# EAGLE schematic schematic hovedboks version 3 (EAGLE 9.6.2)
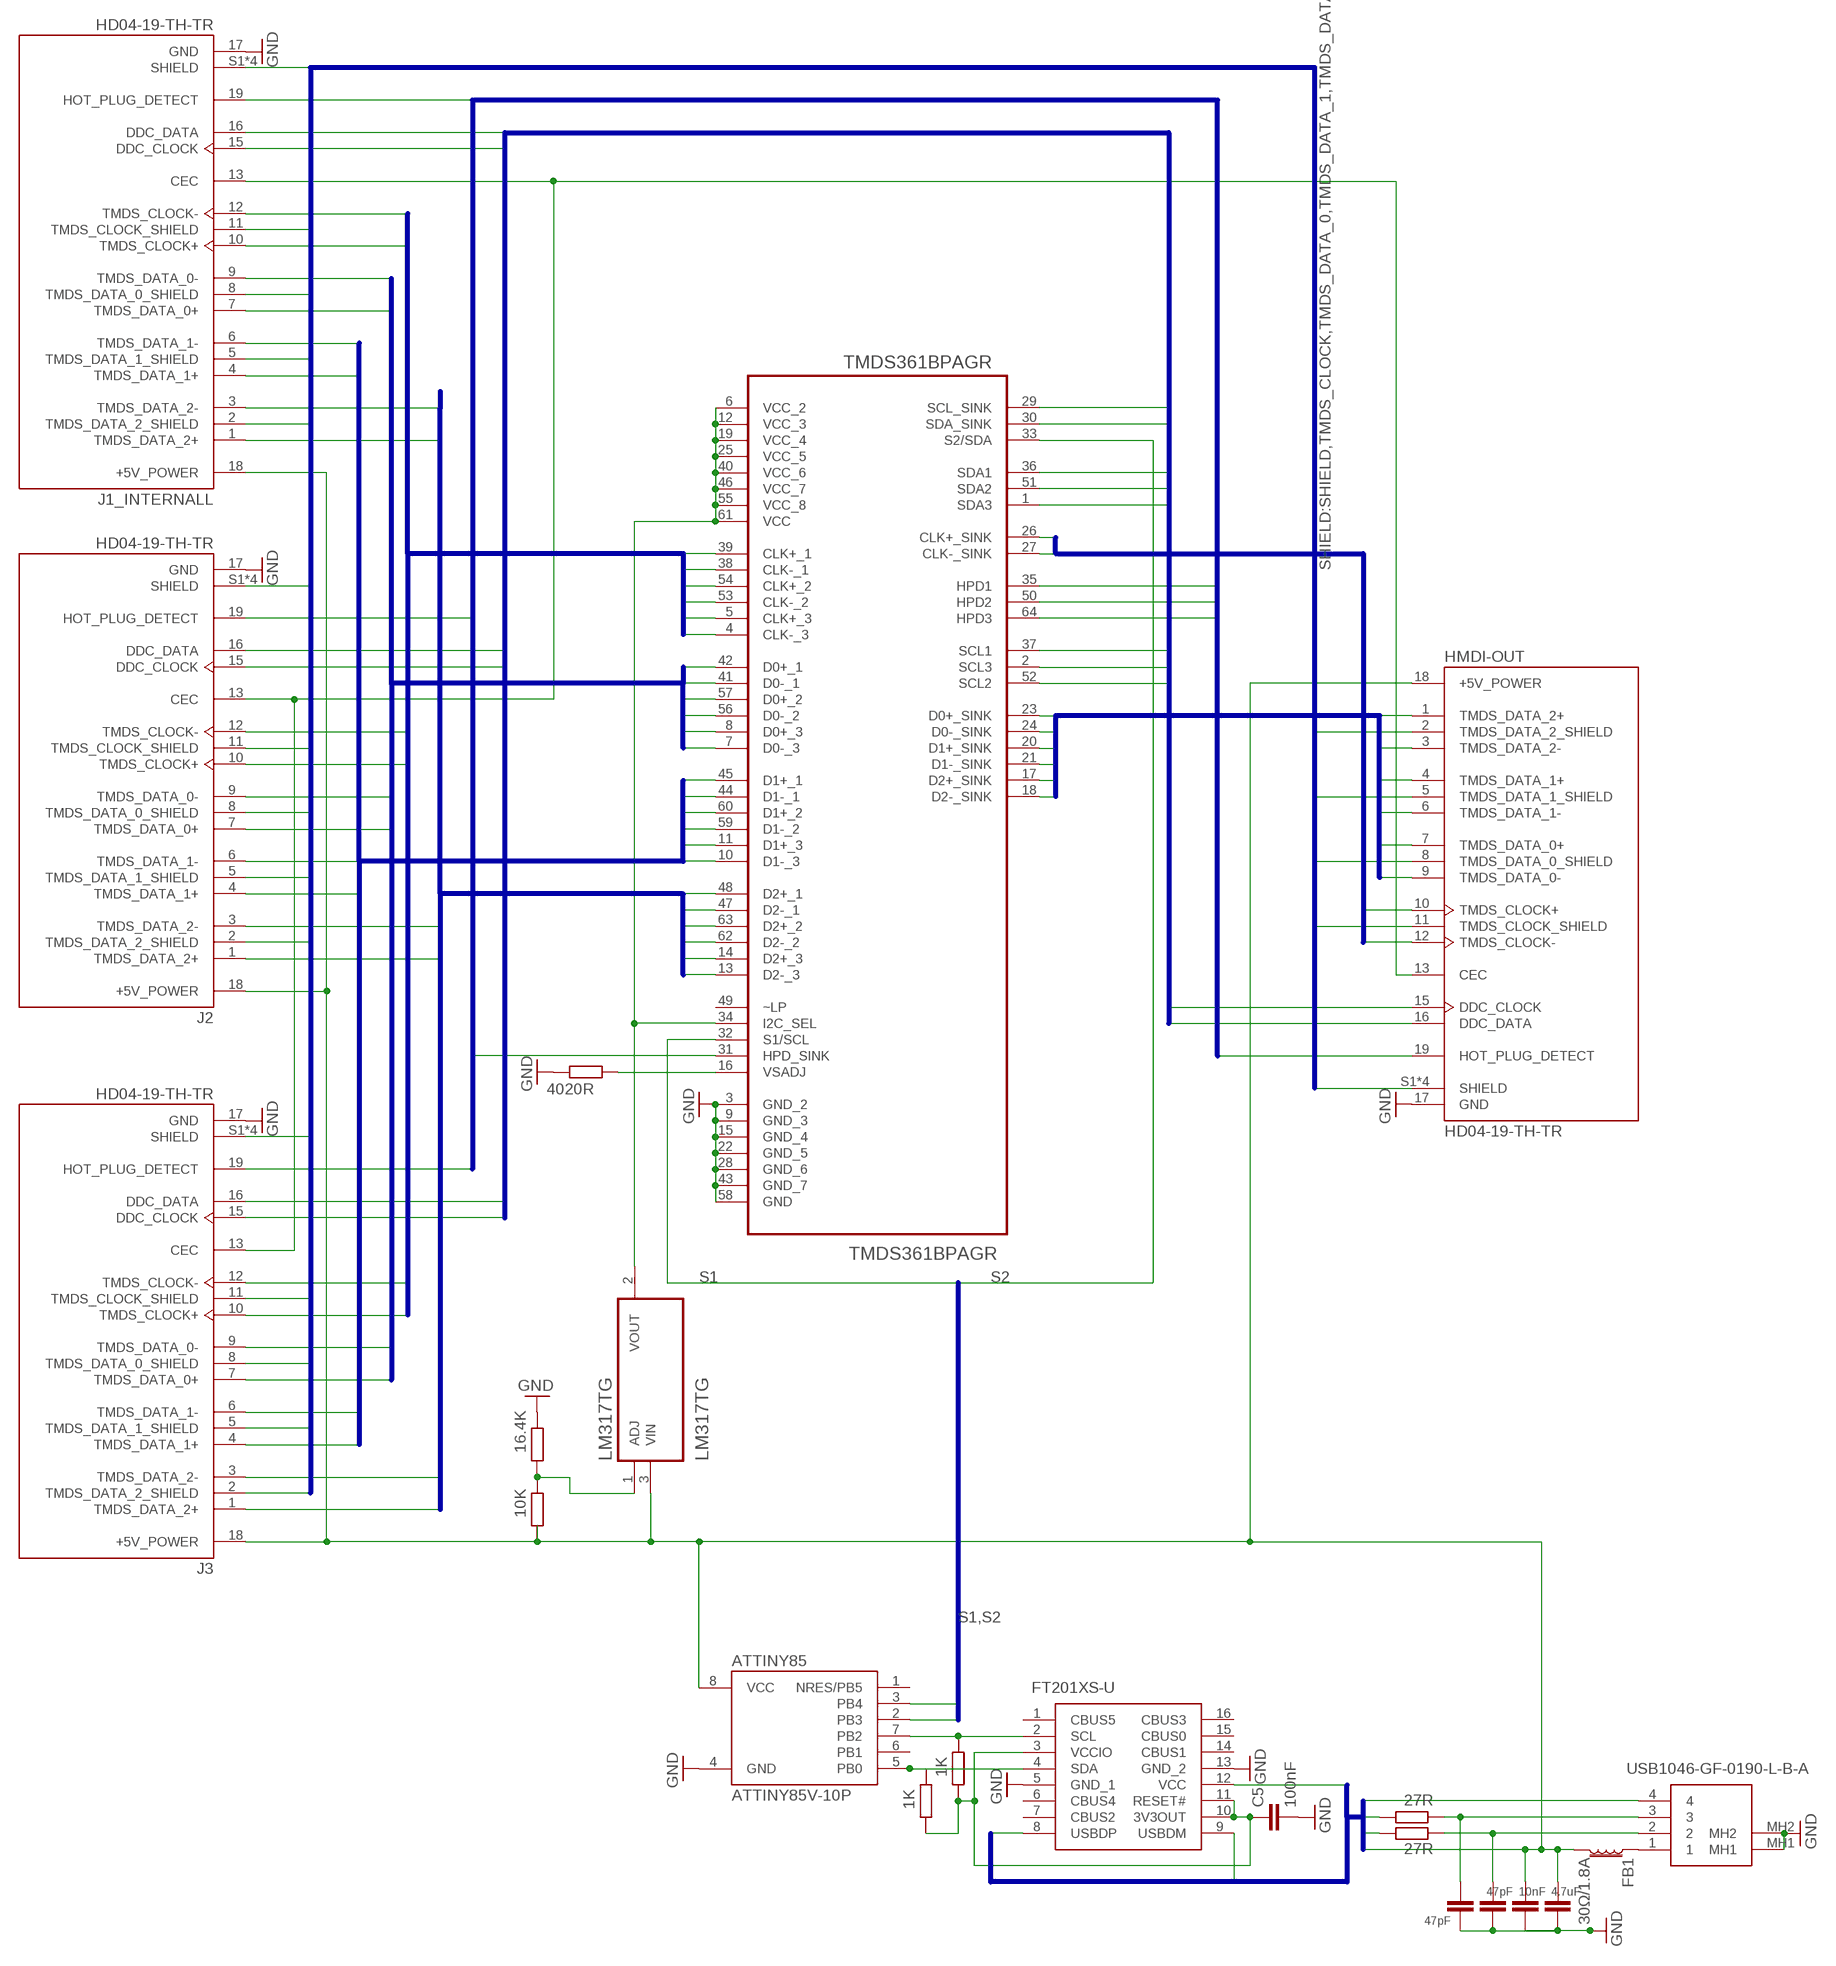
[diagram p0: schematic, sheet 1]

## Parts
ATTINY85  ATTINY85V-10P  [PDIP08_300MIL]
C1  10nF  C-EUC0805  [C0805]
C2  47pF  C-EUC0805  [C0805]
C3  47pF  C-EUC0805  [C0805]
C4  4.7uF  C-EUC0805  [C0805]
C5  100nF  C-EUC0805  [C0805]
FB1  30Ω/1.8A  FERRITE_BEAD-0603  [0603]
HMDI-OUT  HD04-19-TH-TR  [CUI_HD04-19-TH-TR]
IC1  FT201XS-U  [SOP64P599X175-16N]
J1  USB1046-GF-0190-L-B-A  [USB1046GF0190LBA]
J1_INTERNALL  HD04-19-TH-TR  [CUI_HD04-19-TH-TR]
J2  HD04-19-TH-TR  [CUI_HD04-19-TH-TR]
J3  HD04-19-TH-TR  [CUI_HD04-19-TH-TR]
LM317TG  LM317TG  [TO254P1054X470X1955-3]
R1  27R  R-EU_R0805  [R0805]
R2  27R  R-EU_R0805  [R0805]
R3  1K  R-EU_R0805  [R0805]
R5  4020R  R-EU_R0805  [R0805]
R7  1K  R-EU_R0805  [R0805]
R8  10K  R-EU_R0805  [R0805]
R9  16.4K  R-EU_R0805  [R0805]
TMDS361BPAGR  TMDS361BPAGR  [QFP50P1200X1200X120-64N]

## Nets
1: J1_INTERNALL.19(HOT_PLUG_DETECT) TMDS361BPAGR.35(HPD1)
1_CLOCK: J1_INTERNALL.15(DDC_CLOCK) TMDS361BPAGR.37(SCL1)
1_DATA: J1_INTERNALL.16(DDC_DATA) TMDS361BPAGR.36(SDA1)
2: J2.19(HOT_PLUG_DETECT) TMDS361BPAGR.50(HPD2)
2_CLOCK: J2.15(DDC_CLOCK) TMDS361BPAGR.52(SCL2)
2_DATA: J2.16(DDC_DATA) TMDS361BPAGR.51(SDA2)
3: J3.19(HOT_PLUG_DETECT) TMDS361BPAGR.64(HPD3)
3_CLOCK: J3.15(DDC_CLOCK) TMDS361BPAGR.2(SCL3)
3_DATA: J3.16(DDC_DATA) TMDS361BPAGR.1(SDA3)
3V3USBCONTROLLER: C5.1 IC1.3(VCCIO) IC1.10(3V3OUT) IC1.11(RESET#) R3.1 R7.1
CEC_INTERNAL-OUT: HMDI-OUT.13(CEC) J1_INTERNALL.13(CEC) J2.13(CEC) J3.13(CEC)
CLK_1_N [Differential pairs]: J1_INTERNALL.12(TMDS_CLOCK-) TMDS361BPAGR.38(CLK-_1)
CLK_1_P [Differential pairs]: J1_INTERNALL.10(TMDS_CLOCK+) TMDS361BPAGR.39(CLK+_1)
CLK_2_N [Differential pairs]: J2.12(TMDS_CLOCK-) TMDS361BPAGR.53(CLK-_2)
CLK_2_P [Differential pairs]: J2.10(TMDS_CLOCK+) TMDS361BPAGR.54(CLK+_2)
CLK_3_N [Differential pairs]: J3.12(TMDS_CLOCK-) TMDS361BPAGR.4(CLK-_3)
CLK_3_P [Differential pairs]: J3.10(TMDS_CLOCK+) TMDS361BPAGR.5(CLK+_3)
CLK_SINK_N [Differential pairs]: HMDI-OUT.12(TMDS_CLOCK-) TMDS361BPAGR.27(CLK-_SINK)
CLK_SINK_P [Differential pairs]: HMDI-OUT.10(TMDS_CLOCK+) TMDS361BPAGR.26(CLK+_SINK)
D0_1_N [Differential pairs]: J1_INTERNALL.9(TMDS_DATA_0-) TMDS361BPAGR.41(D0-_1)
D0_1_P [Differential pairs]: J1_INTERNALL.7(TMDS_DATA_0+) TMDS361BPAGR.42(D0+_1)
D0_2_N [Differential pairs]: J2.9(TMDS_DATA_0-) TMDS361BPAGR.56(D0-_2)
D0_2_P [Differential pairs]: J2.7(TMDS_DATA_0+) TMDS361BPAGR.57(D0+_2)
D0_3_N [Differential pairs]: J3.9(TMDS_DATA_0-) TMDS361BPAGR.7(D0-_3)
D0_3_P [Differential pairs]: J3.7(TMDS_DATA_0+) TMDS361BPAGR.8(D0+_3)
D0_SINK_N [Differential pairs]: HMDI-OUT.9(TMDS_DATA_0-) TMDS361BPAGR.24(D0-_SINK)
D0_SINK_P [Differential pairs]: HMDI-OUT.7(TMDS_DATA_0+) TMDS361BPAGR.23(D0+_SINK)
D1_1_N [Differential pairs]: J1_INTERNALL.6(TMDS_DATA_1-) TMDS361BPAGR.44(D1-_1)
D1_1_P [Differential pairs]: J1_INTERNALL.4(TMDS_DATA_1+) TMDS361BPAGR.45(D1+_1)
D1_2_N [Differential pairs]: J2.6(TMDS_DATA_1-) TMDS361BPAGR.59(D1-_2)
D1_2_P [Differential pairs]: J2.4(TMDS_DATA_1+) TMDS361BPAGR.60(D1+_2)
D1_3_N [Differential pairs]: J3.6(TMDS_DATA_1-) TMDS361BPAGR.10(D1-_3)
D1_3_P [Differential pairs]: J3.4(TMDS_DATA_1+) TMDS361BPAGR.11(D1+_3)
D1_SINK_N [Differential pairs]: HMDI-OUT.6(TMDS_DATA_1-) TMDS361BPAGR.21(D1-_SINK)
D1_SINK_P [Differential pairs]: HMDI-OUT.4(TMDS_DATA_1+) TMDS361BPAGR.20(D1+_SINK)
D2_1_N [Differential pairs]: J1_INTERNALL.3(TMDS_DATA_2-) TMDS361BPAGR.47(D2-_1)
D2_1_P [Differential pairs]: J1_INTERNALL.1(TMDS_DATA_2+) TMDS361BPAGR.48(D2+_1)
D2_2_N [Differential pairs]: J2.3(TMDS_DATA_2-) TMDS361BPAGR.62(D2-_2)
D2_2_P [Differential pairs]: J2.1(TMDS_DATA_2+) TMDS361BPAGR.63(D2+_2)
D2_3_N [Differential pairs]: J3.3(TMDS_DATA_2-) TMDS361BPAGR.13(D2-_3)
D2_3_P [Differential pairs]: J3.1(TMDS_DATA_2+) TMDS361BPAGR.14(D2+_3)
D2_SINK_N [Differential pairs]: HMDI-OUT.3(TMDS_DATA_2-) TMDS361BPAGR.18(D2-_SINK)
D2_SINK_P [Differential pairs]: HMDI-OUT.1(TMDS_DATA_2+) TMDS361BPAGR.17(D2+_SINK)
GND: ATTINY85.4(GND) C1.2 C2.2 C3.2 C4.2 C5.2 HMDI-OUT.17(GND) IC1.5(GND_1) IC1.13(GND_2) J1.4 J1.MH1 J1.MH2 J1_INTERNALL.17(GND) J2.17(GND) J3.17(GND) R5.2 R9.2 TMDS361BPAGR.3(GND_2) TMDS361BPAGR.9(GND_3) TMDS361BPAGR.15(GND_4) TMDS361BPAGR.22(GND_5) TMDS361BPAGR.28(GND_6) TMDS361BPAGR.43(GND_7) TMDS361BPAGR.58(GND)
N$1: C3.1 J1.3 R1.2
N$2: C2.1 J1.2 R2.2
N$5: FB1.1 J1.1
OUT: HMDI-OUT.19(HOT_PLUG_DETECT) TMDS361BPAGR.31(HPD_SINK)
OUT_CLOCK: HMDI-OUT.15(DDC_CLOCK) TMDS361BPAGR.29(SCL_SINK)
OUT_DATA: HMDI-OUT.16(DDC_DATA) TMDS361BPAGR.30(SDA_SINK)
S1: ATTINY85.2(PB3) TMDS361BPAGR.32(S1/SCL)
S2: ATTINY85.3(PB4) TMDS361BPAGR.33(S2/SDA)
SCL: ATTINY85.7(PB2) IC1.2(SCL) R7.2
SDA: ATTINY85.5(PB0) IC1.4(SDA) R3.2
SHIELD: HMDI-OUT.S1(SHIELD) HMDI-OUT.S2(SHIELD) HMDI-OUT.S3(SHIELD) HMDI-OUT.S4(SHIELD) J1_INTERNALL.S1(SHIELD) J1_INTERNALL.S2(SHIELD) J1_INTERNALL.S3(SHIELD) J1_INTERNALL.S4(SHIELD) J2.S1(SHIELD) J2.S2(SHIELD) J2.S3(SHIELD) J2.S4(SHIELD) J3.S1(SHIELD) J3.S2(SHIELD) J3.S3(SHIELD) J3.S4(SHIELD)
TMDS_CLOCK: HMDI-OUT.11(TMDS_CLOCK_SHIELD) J1_INTERNALL.11(TMDS_CLOCK_SHIELD) J2.11(TMDS_CLOCK_SHIELD) J3.11(TMDS_CLOCK_SHIELD)
TMDS_DATA_0: HMDI-OUT.8(TMDS_DATA_0_SHIELD) J1_INTERNALL.8(TMDS_DATA_0_SHIELD) J2.8(TMDS_DATA_0_SHIELD) J3.8(TMDS_DATA_0_SHIELD)
TMDS_DATA_1: HMDI-OUT.5(TMDS_DATA_1_SHIELD) J1_INTERNALL.5(TMDS_DATA_1_SHIELD) J2.5(TMDS_DATA_1_SHIELD) J3.5(TMDS_DATA_1_SHIELD)
TMDS_DATA_2: HMDI-OUT.2(TMDS_DATA_2_SHIELD) J1_INTERNALL.2(TMDS_DATA_2_SHIELD) J2.2(TMDS_DATA_2_SHIELD) J3.2(TMDS_DATA_2_SHIELD)
USB_N: IC1.9(USBDM) R2.1
USB_P: IC1.8(USBDP) R1.1
VCC5V: ATTINY85.8(VCC) C1.1 C4.1 FB1.2 HMDI-OUT.18(+5V_POWER) IC1.12(VCC) J1_INTERNALL.18(+5V_POWER) J2.18(+5V_POWER) J3.18(+5V_POWER) LM317TG.3(VIN) R8.1
VCC_3.3V: LM317TG.2(VOUT) TMDS361BPAGR.6(VCC_2) TMDS361BPAGR.12(VCC_3) TMDS361BPAGR.19(VCC_4) TMDS361BPAGR.25(VCC_5) TMDS361BPAGR.34(I2C_SEL) TMDS361BPAGR.40(VCC_6) TMDS361BPAGR.46(VCC_7) TMDS361BPAGR.55(VCC_8) TMDS361BPAGR.61(VCC)
VOLTAGE_CONTROLL: LM317TG.1(ADJ) R8.2 R9.1
VSADJ: R5.1 TMDS361BPAGR.16(VSADJ)
Unconnected: ATTINY85.1(NRES/PB5) ATTINY85.6(PB1) IC1.1(CBUS5) IC1.6(CBUS4) IC1.7(CBUS2) IC1.14(CBUS1) IC1.15(CBUS0) IC1.16(CBUS3) TMDS361BPAGR.49(~LP)

## Buses
SHIELD:SHIELD,TMDS_CLOCK,TMDS_DATA_0,TMDS_DATA_1,TMDS_DATA_2
HPD:1,2,3,OUT
DDC:1_CLOCK,1_DATA,2_CLOCK,2_DATA,3_CLOCK,3_DATA,OUT_CLOCK,OUT_DATA
S1,S2
TMDS_DATA_2:D2_1_N,D2_1_P,D2_2_N,D2_2_P,D2_3_N,D2_3_P
TMDS_DATA_1:D1_1_N,D1_1_P,D1_2_N,D1_2_P,D1_3_N,D1_3_P
TMDS_DATA_0:D0_1_N,D0_1_P,D0_2_N,D0_2_P,D0_3_N,D0_3_P
TMDS_CLOCK:CLK_1_N,CLK_1_P,CLK_2_N,CLK_2_P,CLK_3_N,CLK_3_P
TMDS_DATA_OUT:D0_SINK_N,D0_SINK_P,D1_SINK_N,D1_SINK_P,D2_SINK_N,D2_SINK_P
TMDS_CLK_OUT:CLK_SINK_N,CLK_SINK_P
GND,USB_N,USB_P,VCC5V

## Library data of the parts
ATTINY85 = _hhn_attiny25_45_85:ATTINY85*: ATMEL ATtiny 85 Packages: P = PDIP 08 30mil S = SOIC 08 EIAJ 208mil Technologies Note: for complete ordering code (temp. range, finish, tape&reel etc.) see www.atmel.com • Supply Voltage: V = (1.8…5.5)V | [blank] = (2.7…5.5)V • Speed: 10 = 10 MHz | 20 = 20 MHz Author: Dipl.-Ing. FH Rainer Bayer HHN Hochschule Heilbronn (Heilbronn University), rainer.bayer@hs-heilbronn.de Ingenieurbüro ing-rb, mail@ing-rb.de
C1-C5 = rcl:C-EU: CAPACITOR, European symbol; SPICEPREFIX: C
FB1 = SparkFun-Coils:FERRITE_BEAD: Ferrite Bead (blocks, cores, rings, chokes, etc.) Inductor with layers of ferrite used to suppress high frequencies. Often used to isolate high frequency noise. SparkFun Products: IOIO-OTG - V2.2 <https://www.sparkfun.com/products/13613> SparkFun SAMD21 Mini Breakout <https://www.sparkfun.com/products/13664> SparkFun 6 Degrees of Freedom Breakout - LSM6DS3 <https://www.sparkfun.com/products/13339> SparkFun SAMD21 Dev Breakout <https://www.sparkfun.com/products/13672>; PROD_ID: NDUC-07859
HMDI-OUT J1_INTERNALL J2 J3 = HD04-19-TH-TR:HD04-19-TH-TR: HDMI RECEPTACLE; MANUFACTURER: CUI Devices; MAXIMUM_PACKAGE_HEIGHT: 6.27mm; PARTREV: 1.0; STANDARD: Manufacturer Recommendations
IC1 = FT201XS-U:FT201XS-U: Full Speed USB to I2C Interface USB 2.0 5V Tube 16-Pin SSOP Source: Datasheet <http://www.ftdichip.com/Support/Documents/DataSheets/ICs/DS_FT201X.pdf>; ARROW_PART_NUMBER: FT201XS-U; ARROW_PRICE-STOCK: https://www.arrow.com/en/products/ft201xs-u/ftdi-chip; DESCRIPTION: Full Speed USB to I2C Interface USB 2.0 5V Tube 16-Pin SSOP; HEIGHT: 1.753mm; MANUFACTURER_NAME: FTDI Chip; MANUFACTURER_PART_NUMBER: FT201XS-U; MOUSER_PART_NUMBER: 895-FT201XS-U; MOUSER_PRICE-STOCK: https://www.mouser.co.uk/ProductDetail/FTDI/FT201XS-U?qs=Gp1Yz1mis3WB8%2FosoP460g%3D%3D
J1 = USB1046-GF-0190-L-B-A:USB1046-GF-0190-L-B-A: USB Connectors USB A Skt, Top Mount, SMT, R/A, GF, Black, With 1.9mm shell stake, T&R Source: Datasheet <https://gct.co/files/drawings/usb1046.pdf?v=ccb5d20d-0631-4297-aa3c-9c34fccf9fbc>; DESCRIPTION: USB Connectors USB A Skt, Top Mount, SMT, R/A, GF, Black, With 1.9mm shell stake, T&R; HEIGHT: 7.2mm; MANUFACTURER_NAME: GCT (GLOBAL CONNECTOR TECHNOLOGY); MANUFACTURER_PART_NUMBER: USB1046-GF-0190-L-B-A; MOUSER_PART_NUMBER: 640-USB1046GF0190LBA; MOUSER_PRICE-STOCK: https://www.mouser.co.uk/ProductDetail/GCT/USB1046-GF-0190-L-B-A?qs=KUoIvG%2F9IlbZOJtEsn1unA%3D%3D
LM317TG = LM317TG:LM317TG: Check prices <https://pricing.snapeda.com/parts/LM317TG/ON%20Semiconductor/view-part?ref=eda>; AVAILABILITY: In Stock; DESCRIPTION: Linear Voltage Regulator IC Positive Adjustable 1 Output 1.5A TO-220-3; MF: ON Semiconductor; MP: LM317TG; PACKAGE: TO-220-3 ON Semiconductor; PRICE: None; PURCHASE-URL: https://pricing.snapeda.com/search/part/LM317TG/?ref=eda
R1-R3 R5 R7-R9 = rcl:R-EU_: RESISTOR, European symbol; SPICEPREFIX: R
TMDS361BPAGR = Texas Instruments_By_element14_Batch_1:TMDS361BPAGR: Three-Port HDMI Switch; MPN: TMDS361BPAGR; OC_FARNELL: -; OC_NEWARK: 55R7479; PACKAGE: TQFP-64; SUPPLIER: Texas Instruments

## Net classes
0 default: clearance 0.178 mm
1 Differential pairs: width 0.192 mm, clearance 0.178 mm